# EAGLE schematic projeto eagle (EAGLE 9.6.2)
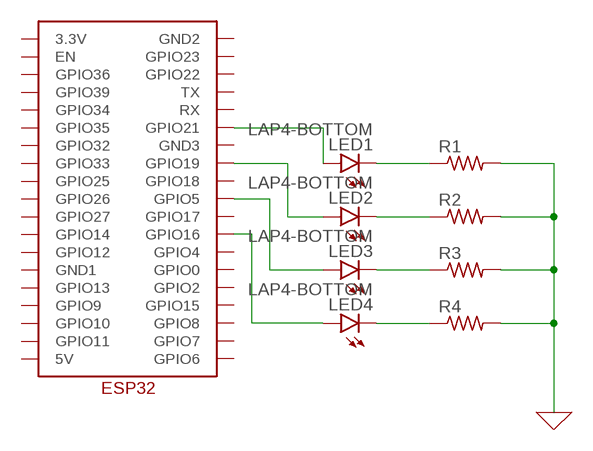
[diagram p0: schematic, sheet 1]

## Parts
LED1  LAP4-BOTTOM  [P47F-BOTTOM]
LED2  LAP4-BOTTOM  [P47F-BOTTOM]
LED3  LAP4-BOTTOM  [P47F-BOTTOM]
LED4  LAP4-BOTTOM  [P47F-BOTTOM]
R1  R-US_0204/2V  [0204V]
R2  R-US_0204/2V  [0204V]
R3  R-US_0204/2V  [0204V]
R4  R-US_0204/2V  [0204V]
U$1  ESP32  [ESP32]

## Nets
0: R1.2 R2.2 R3.2 R4.2 ; supply symbol labelled GND
N$1: LED1.C R1.1
N$2: LED2.C R2.1
N$3: LED3.C R3.1
N$4: LED4.C R4.1
N$5: LED1.A U$1.GPIO21
N$6: LED2.A U$1.GPIO19
N$7: LED3.A U$1.GPIO5
N$8: LED4.A U$1.GPIO16
Unconnected: U$1.3.3V U$1.5V U$1.EN U$1.GND1 U$1.GND2 U$1.GND3 U$1.GPIO0 U$1.GPIO2 U$1.GPIO4 U$1.GPIO6 U$1.GPIO7 U$1.GPIO8 U$1.GPIO9 U$1.GPIO10 U$1.GPIO11 U$1.GPIO12 U$1.GPIO13 U$1.GPIO14 U$1.GPIO15 U$1.GPIO17 U$1.GPIO18 U$1.GPIO22 U$1.GPIO23 U$1.GPIO25 U$1.GPIO26 U$1.GPIO27 U$1.GPIO32 U$1.GPIO33 U$1.GPIO34 U$1.GPIO35 U$1.GPIO36 U$1.GPIO39 U$1.RX U$1.TX

## Library data of the parts
LED1-LED4 = led:*P4: PointLED® Enhanced Thinfilm LED TOP & BOTTOM mount LS P47F, LR P47F, LA P47F, LY P47F, LT P4SG, LB P4SG, LW P4SG Source: http://catalog.osram-os.com .. LA_LR_LS_LY_P47F_Pb_free.pdf
R1-R4 = rcl:R-US_: RESISTOR, American symbol; SPICEPREFIX: R
U$1 = ESP32:ESP32